# EasyEDA Pro project tianmengxing-expansion-board.epro, board PCB1
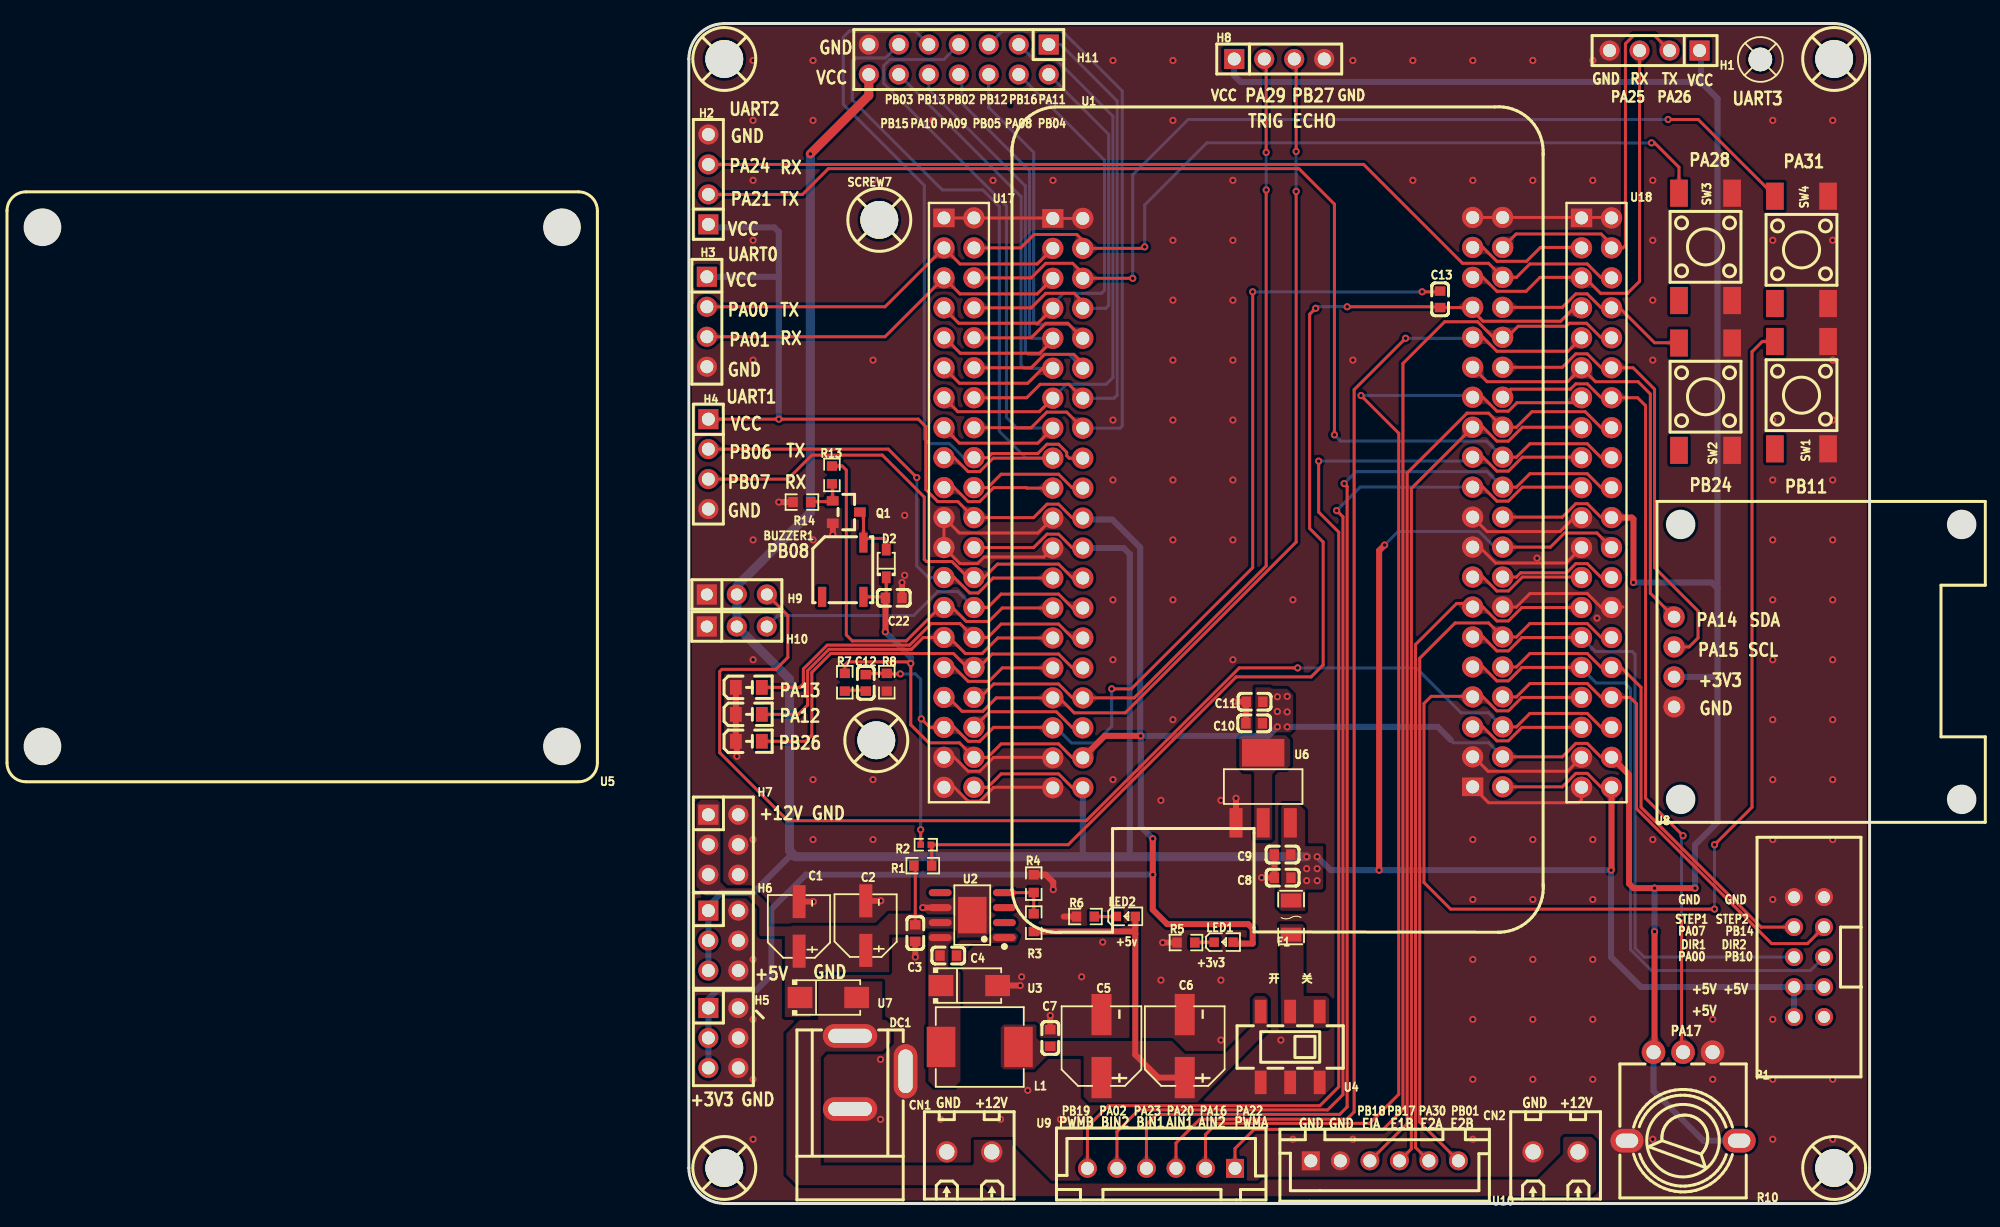
[diagram p2: board, top side]
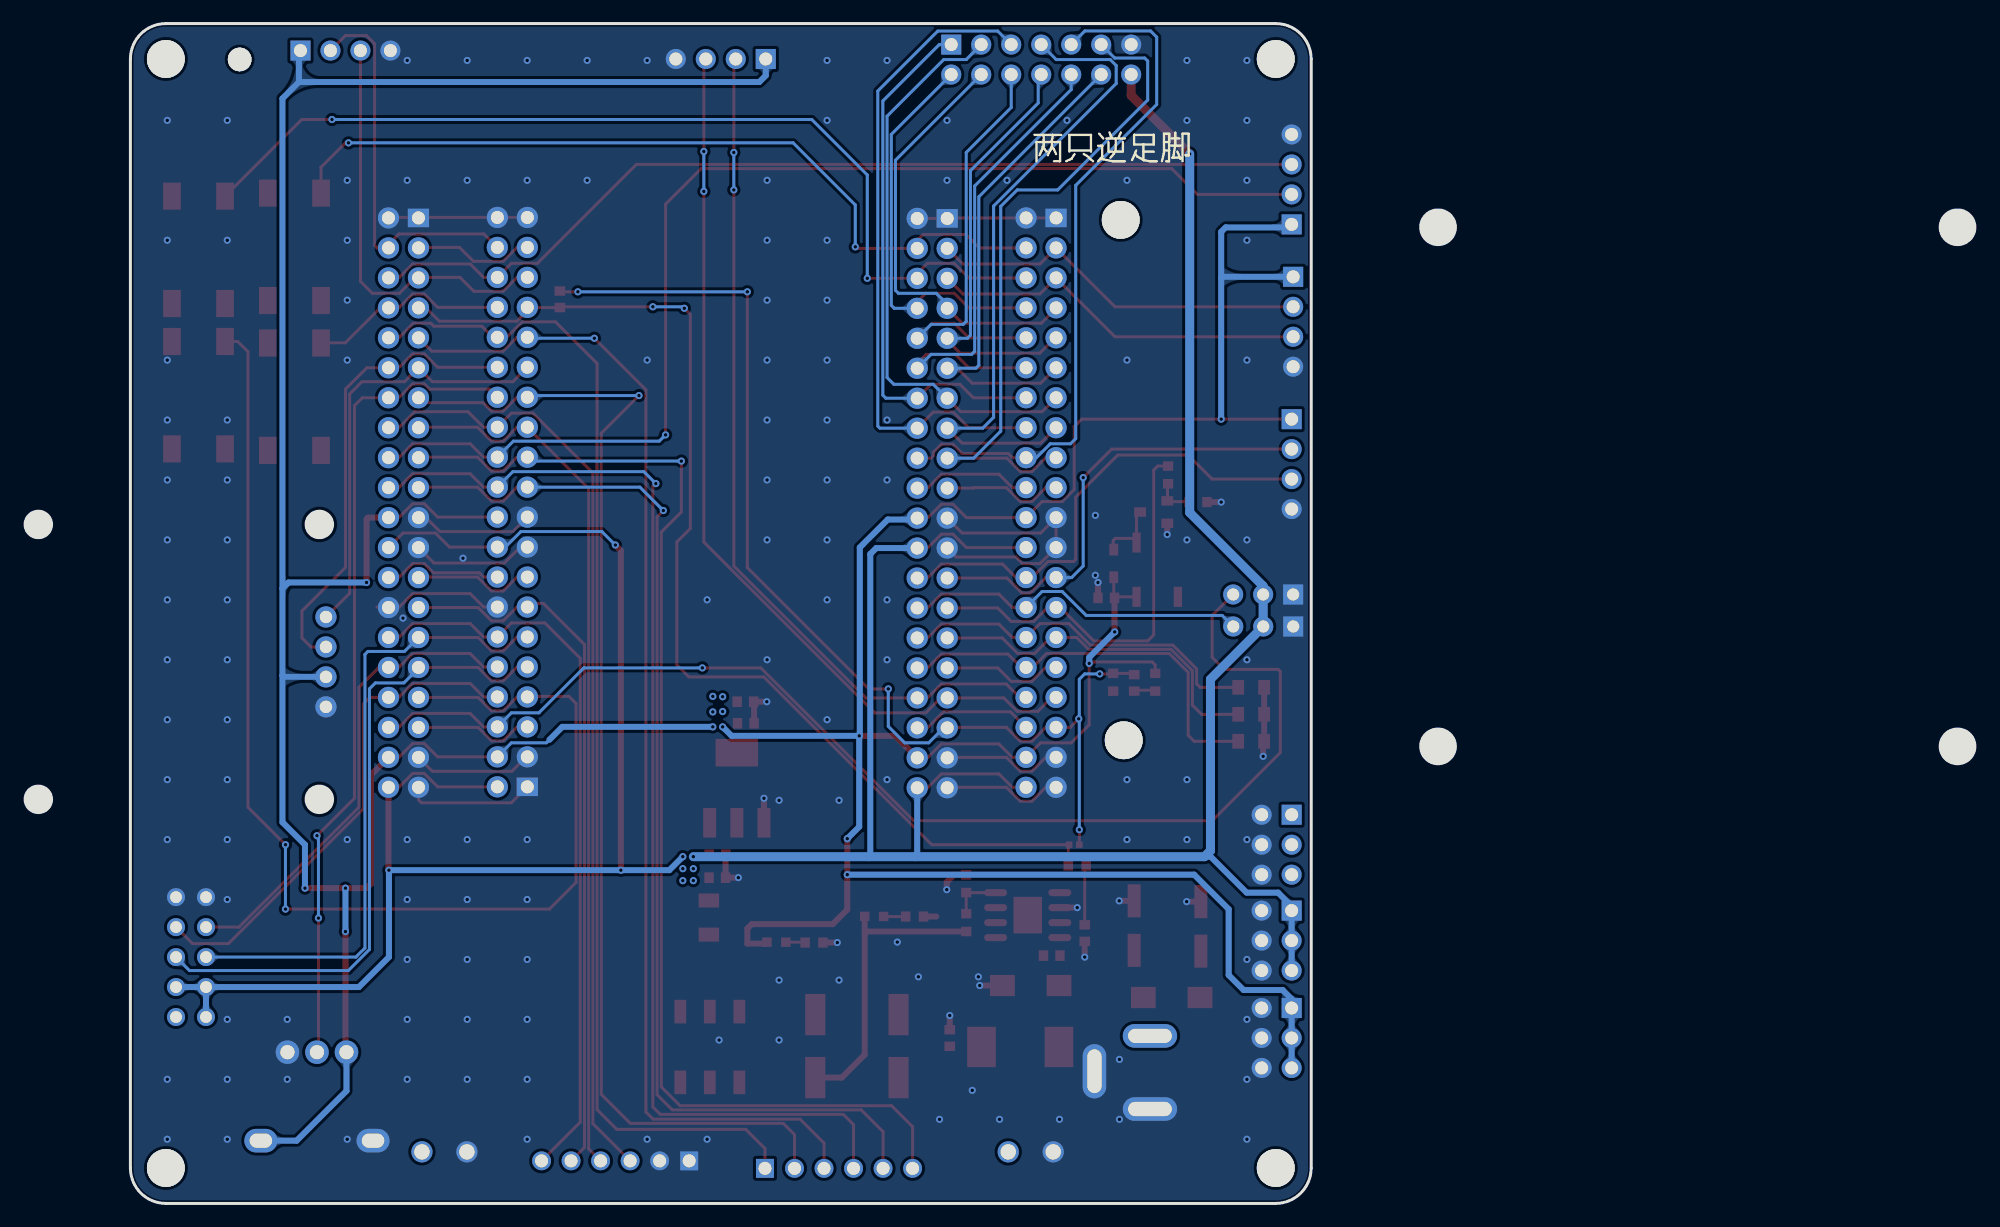
[diagram p3: board, bottom side, seen from below]

Outline 165.39 x 100 mm; copper layers: Top Layer, Bottom Layer. Coordinates in mm from the lower left corner of the outline.
Outline path: 56.34,97 56.34,3 arc(57.22,0.88) 59.34,0 153.34,0 arc(155.46,0.88) 156.34,3 156.34,97 arc(155.46,99.12) 153.34,100 59.34,100 arc(57.22,99.12) 56.34,97
Stack: Top Layer 0.035mm / Dielectric1 1.51mm FR4 er 4.5 / Bottom Layer 0.035mm

## Design rules (mm)
net GND: POWER
net DC+5V: POWER
net +12V: POWER
net VCC+3.3V: POWER
net VCC+5V: POWER
net VCCA+3.3V: POWER
spacing copperThickness1oz (default): track to track 0.102, other pairs 0.152 to 0.3
spacing copperThickness2oz: track to track 0.203, other pairs 0.152 to 0.3
track width copperThickness1oz (default): min 0.127, default 0.254, max 2.54
track width copperThickness2oz: min 0.203, default 0.254, max 2.54
track width POWER: min 0.254, default 0.508, max 2.54
differential pair differentialPair (default): width min 0.127, default 0.254, max 2.54; gap min 0.152, default 0.152
net +12V uses POWER, copperRegion
net DC+5V uses POWER
net GND uses POWER, copperRegion
net VCC+3.3V uses POWER, copperRegion
net VCC+5V uses POWER, copperRegion
net VCCA+3.3V uses POWER
net class POWER uses POWER

## Placement (name value [footprint] x y rotation side)
BUZZER1  4kHz  [BUZ-SMD_L5.0-W5.5-P4.60]  69.38 53.71 90 top
C1  4.7uF  [CAP-SMD_BD5.0-L5.3-W5.3-FD]  65.68 23.48 90 top
C2  4.7uF  [CAP-SMD_BD5.0-L5.3-W5.3-FD]  71.33 23.55 90 top
C3  100nF  [C0603]  75.52 22.91 90 top
C4  10nF  [C0603]  78.31 21.01 180 top
C5  100uF  [CAP-SMD_BD6.3-L6.6-W6.6-LS7.6-FD-1]  91.29 13.33 90 top
C6  100uF  [CAP-SMD_BD6.3-L6.6-W6.6-LS7.6-FD-1]  98.34 13.33 90 top
C7  100nF  [C0603]  86.95 14.02 270 top
C8  10uF  [C0603]  106.63 27.61 0 top
C9  100nF  [C0603]  106.62 29.57 0 top
C10  10uF  [C0603]  104.22 40.69 0 top
C11  100nF  [C0603]  104.25 42.52 0 top
C12  100nF  [C0603]  71.33 44.12 270 top
C13  100nF  [C0603]  119.97 76.63 270 top
C22  100nF  [C0603]  73.7 51.32 0 top
CN1  MX128L-3.81-02P-GN01-Cu-Y-A  [CONN-TH_2P-P3.81_MX128L-3.81-GN01-02P-CU-Y-A]  80.09 4.37 0 top
CN2  MX128L-3.81-02P-GN01-Cu-Y-A  [CONN-TH_2P-P3.81_MX128L-3.81-GN01-02P-CU-Y-A]  129.75 4.37 0 top
D2  1N5819WS  [SOD-323_L1.8-W1.3-LS2.5-RD]  73.06 54.24 90 top
DC1  -  [DC-005_2.5]  70.31 10.97 270 top
F1  JK-nSMD050-30  [F1206]  107.35 24.23 90 top
H1  2.54-1*4P母  [HDR-TH_4P-P2.54-V-F]  138.13 97.71 180 top
H2  PZ254V-11-04P  [HDR-TH_4P-P2.54-V-M]  57.99 86.79 90 top
H3  2.54-1*4P母  [HDR-TH_4P-P2.54-V-F]  57.87 74.73 270 top
H4  PZ254V-11-04P  [HDR-TH_4P-P2.54-V-M]  57.99 62.66 270 top
H5  PZ254V-12-6P  [HDR-TH_6P-P2.54-V-M-R2-C3-S2.54]  59.26 14.02 270 top
H6  PZ254V-12-6P  [HDR-TH_6P-P2.54-V-M-R2-C3-S2.54]  59.26 22.28 270 top
H7  PZ254V-12-6P  [HDR-TH_6P-P2.54-V-M-R2-C3-S2.54]  59.26 30.4 270 top
H8  2.54-1*4P母  [HDR-TH_4P-P2.54-V-F]  106.34 97 0 top
H9  PZ254V-11-03P  [HDR-TH_3P-P2.54-V-M_PZ254V-11-03P]  60.41 51.61 0 top
H10  PZ254V-11-03P  [HDR-TH_3P-P2.54-V-M_PZ254V-11-03P]  60.4 48.9 0 top
H11  PZ254V-12-14P  [HDR-TH_14P-P2.54-V-M-R2-C7-S2.54]  79.2 96.95 180 top
L1  15uH  [IND-SMD_L7.3-W6.6]  80.98 13.26 180 top
LED1  -  [LED_0603]  101.68 22.15 0 top
LED2  -  [LED_0603]  93.4 24.33 0 top
LED3  NCD0805R1  [LED0805-RD]  61.42 43.74 0 top
LED4  NCD0805R1  [LED0805-RD]  61.42 41.45 0 top
LED5  NCD0805R1  [LED0805-RD]  61.42 39.17 0 top
P1  2.54-2*5P简牛  [IDC-TH_10P-P2.54_C5665]  151.21 20.88 90 top
Q1  SS8050  [SOT-23_L2.9-W1.3-P1.90-LS2.4-BR]  69.68 58.6 180 top
R1  33kΩ  [R0603]  76.15 28.63 180 top
R2  10kΩ  [R0402]  76.41 30.4 0 top
R3  10K  [R0603]  85.55 23.8 270 top
R4  3.16K  [R0603]  85.55 27.1 90 top
R5  2K  [R0603]  98.44 22.11 0 top
R6  5K  [R0603]  89.93 24.31 0 top
R7  0  [R0603]  69.55 44.17 270 top
R8  0  [R0603]  73.11 44.17 90 top
R10  10kΩ  [RES-ADJ-TH_RK09L1140A5L]  140.54 9.07 180 top
R13  560Ω  [R0603]  68.46 61.75 270 top
R14  10kΩ  [R0603]  65.92 59.44 180 top
SCREW1  -  [M3螺丝]  59.34 97 0 top
SCREW2  -  [M3螺丝]  153.34 97 0 top
SCREW3  -  [M3螺丝]  59.34 3 0 top
SCREW4  -  [M3螺丝]  153.34 3 0 top
SCREW5  -  [M2螺丝]  147.09 96.96 0 top
SCREW7  -  [M3螺丝]  72.47 83.36 0 top
SCREW8  -  [M3螺丝]  72.22 39.25 0 top
SW1  KH-6X6X5H-STM  [SW-SMD_4P-L6.0-W6.0-P4.50-LS9.0_H5.0]  150.58 68.5 270 top
SW2  KH-6X6X5H-STM  [SW-SMD_4P-L6.0-W6.0-P4.50-LS9.0_H5.0]  142.45 68.38 270 top
SW3  KH-6X6X5H-STM  [SW-SMD_4P-L6.0-W6.0-P4.50-LS9.0_H5.0]  142.45 81.08 270 top
SW4  KH-6X6X5H-STM  [SW-SMD_4P-L6.0-W6.0-P4.50-LS9.0_H5.0]  150.58 80.82 270 top
U1  LCKFB-TMX-MSPM0G3507  [COMM-TH_LCKFB-TMX-MSPM0G3507]  106.22 59.4 0 top
U2  TPS5450QDDARQ1  [SOIC-8_L4.9-W3.9-P1.27-LS6.0-BL-EP]  80.35 24.44 90 top
U3  SS54  [SMA_L4.2-W2.6-LS5.1-RD]  80.09 18.47 0 top
U4  YSSP2AG00  [SW-SMD_YSSP2AG00]  107.27 13.26 180 top
U5  -  [轮趣科技电机驱动]  48.6 35.74 180 top
U6  AMS1117-3.3  [SOT-223-3_L6.5-W3.4-P2.30-LS7.0-BR]  104.98 35.23 270 top
U7  SS54  [SMA_L4.2-W2.6-LS5.1-RD]  68.15 17.45 0 top
U8  HS96L03W2C03  [OLED-TH_L27.8-W27.2-P2.54_C9900033791]  139.78 45.9 90 top
U9  ZX-XH2.54-6PZZ  [CONN-TH_6P-P2.50_ZX-XH2.54-6PZZ]  96.35 2.97 0 top
U10  ZX-XH2.54-6PZZ  [CONN-TH_6P-P2.50_ZX-XH2.54-6PZZ]  115.27 3.61 180 top
U17  PZ2.54-2*20  [HDR-TH_40P-P2.54-V-M-R2-C20-S2.54]  79.22 59.4 270 top
U18  PZ2.54-2*20  [HDR-TH_40P-P2.54-V-M-R2-C20-S2.54]  133.22 59.4 270 top

## Footprints (pads in the part's own frame, mm; a bottom-side part is the same pattern mirrored in y, then rotated)
BUZ-SMD_L5.0-W5.5-P4.60
  rect 1.7x0.7 smd: 1(-2.3,-1.75) 2(2.3,-1.75) 3(-2.3,1.75)
C0603
  rect 0.8x0.9 smd: 1(-0.7,0) 2(0.7,0)
CAP-SMD_BD5.0-L5.3-W5.3-FD
  rect 2.8x1.1 smd: 1(-2.1,0) 2(2.1,0)
CAP-SMD_BD6.3-L6.6-W6.6-LS7.6-FD-1
  rect 3.5x1.7 smd: 1(-2.67,0) 2(2.67,0)
COMM-TH_LCKFB-TMX-MSPM0G3507
  rect 1.8x1.575 hole 1.1: 1(-19.05,24.09) 41(16.51,-24.09)
  round 1.8 hole 1.1: 2(-16.51,24.09) 3(-19.05,21.549) 4(-16.51,21.549) 5(-19.05,19.009) 6(-16.51,19.009) 7(-19.05,16.47) 8(-16.51,16.47) 9(-19.05,13.93) 10(-16.51,13.93) 11(-19.05,11.389) 12(-16.51,11.389) 13(-19.05,8.85) 14(-16.51,8.85) 15(-19.05,6.309) 16(-16.51,6.309) 17(-19.05,3.769) 18(-16.51,3.769) 19(-19.05,1.23) 20(-16.51,1.23) 21(-19.05,-1.31) 22(-16.51,-1.31) 23(-19.05,-3.85) 24(-16.51,-3.85) 25(-19.05,-6.391) 26(-16.51,-6.391) 27(-19.05,-8.931) 28(-16.51,-8.931) 29(-19.05,-11.47) 30(-16.51,-11.47) 31(-19.05,-14.011) 32(-16.51,-14.011) 33(-19.05,-16.55) 34(-16.51,-16.55) 35(-19.05,-19.09) 36(-16.51,-19.09) 37(-19.05,-21.631) 38(-16.51,-21.631) 39(-19.05,-24.171) 40(-16.51,-24.171) 42(19.05,-24.09) 43(16.51,-21.549) 44(19.05,-21.549) 45(16.51,-19.009) 46(19.05,-19.009) 47(16.51,-16.47) 48(19.05,-16.47) 49(16.51,-13.93) 50(19.05,-13.93) 51(16.51,-11.389) 52(19.05,-11.389) 53(16.51,-8.85) 54(19.05,-8.85) 55(16.51,-6.309) 56(19.05,-6.309) 57(16.51,-3.769) 58(19.05,-3.769) 59(16.51,-1.23) 60(19.05,-1.23) 61(16.51,1.31) 62(19.05,1.31) 63(16.51,3.85) 64(19.05,3.85) 65(16.51,6.391) 66(19.05,6.391) 67(16.51,8.931) 68(19.05,8.931) 69(16.51,11.47) 70(19.05,11.47) 71(16.51,14.011) 72(19.05,14.011) 73(16.51,16.55) 74(19.05,16.55) 75(16.51,19.09) 76(19.05,19.09) 77(16.51,21.631) 78(19.05,21.631) 79(16.51,24.171) 80(19.05,24.171)
CONN-TH_2P-P3.81_MX128L-3.81-GN01-02P-CU-Y-A
  round 1.8 hole 1.3: 1(-1.905,0) 2(1.905,0)
CONN-TH_6P-P2.50_ZX-XH2.54-6PZZ
  rect 1.524x1.6 hole 1.1: 1(6.25,0)
  round 1.6 hole 1.1: 2(3.75,0) 3(1.25,0) 4(-1.25,0) 5(-3.75,0) 6(-6.25,0)
DC-005_2.5
  oval 2x4.6 hole 1.2x3.7: 1(-3.227,-0.318) 2(2.973,-0.318)
  oval 4.6x2 hole 3.7x1.2: 3(-0.227,4.382)
F1206
  rect 1.19x1.728 smd: 1(-1.445,0) 2(1.445,0)
HDR-TH_3P-P2.54-V-M_PZ254V-11-03P
  rect 1.7x1.7 hole 1.02: 1(-2.54,0)
  round 1.7 hole 1.02: 2(0,0) 3(2.54,0)
HDR-TH_4P-P2.54-V-F
  rect 1.7x1.7 hole 1.1: 1(-3.81,0)
  round 1.7 hole 1.1: 2(-1.27,0) 3(1.27,0) 4(3.81,0)
HDR-TH_4P-P2.54-V-M
  rect 1.7x1.7 hole 1.1: 1(-3.81,0)
  round 1.7 hole 1.1: 2(-1.27,0) 3(1.27,0) 4(3.81,0)
HDR-TH_6P-P2.54-V-M-R2-C3-S2.54
  rect 1.7x1.7 hole 1.1: 1(-2.54,-1.27)
  round 1.7 hole 1.1: 2(-2.54,1.27) 3(0,-1.27) 4(0,1.27) 5(2.54,-1.27) 6(2.54,1.27)
HDR-TH_14P-P2.54-V-M-R2-C7-S2.54
  rect 1.7x1.7 hole 1.1: 1(-7.62,-1.27)
  round 1.7 hole 1.1: 2(-7.62,1.27) 3(-5.08,-1.27) 4(-5.08,1.27) 5(-2.54,-1.27) 6(-2.54,1.27) 7(0,-1.27) 8(0,1.27) 9(2.54,-1.27) 10(2.54,1.27) 11(5.08,-1.27) 12(5.08,1.27) 13(7.62,-1.27) 14(7.62,1.27)
HDR-TH_40P-P2.54-V-M-R2-C20-S2.54
  rect 1.575x1.8 hole 1.1: 1(-24.13,-1.27)
  round 1.8 hole 1.1: 2(-24.13,1.27) 3(-21.59,-1.27) 4(-21.59,1.27) 5(-19.05,-1.27) 6(-19.05,1.27) 7(-16.51,-1.27) 8(-16.51,1.27) 9(-13.97,-1.27) 10(-13.97,1.27) 11(-11.43,-1.27) 12(-11.43,1.27) 13(-8.89,-1.27) 14(-8.89,1.27) 15(-6.35,-1.27) 16(-6.35,1.27) 17(-3.81,-1.27) 18(-3.81,1.27) 19(-1.27,-1.27) 20(-1.27,1.27) 21(1.27,-1.27) 22(1.27,1.27) 23(3.81,-1.27) 24(3.81,1.27) 25(6.35,-1.27) 26(6.35,1.27) 27(8.89,-1.27) 28(8.89,1.27) 29(11.43,-1.27) 30(11.43,1.27) 31(13.97,-1.27) 32(13.97,1.27) 33(16.51,-1.27) 34(16.51,1.27) 35(19.05,-1.27) 36(19.05,1.27) 37(21.59,-1.27) 38(21.59,1.27) 39(24.13,-1.27) 40(24.13,1.27)
IDC-TH_10P-P2.54_C5665
  round 1.524 hole 1: 1(-5.08,-1.27) 2(-5.08,1.27) 3(-2.54,-1.27) 4(-2.54,1.27) 5(0,-1.27) 6(0,1.27) 7(2.54,-1.27) 8(2.54,1.27) 9(5.08,-1.27) 10(5.08,1.27)
IND-SMD_L7.3-W6.6
  rect 2.424x3.42 smd: 1(3.278,0) 2(-3.278,0)
LED0805-RD
  rect 1x1.25 smd: 1(-1.1,0) 2(1.1,0)
LED_0603
  rect 0.8x0.8 smd: 1(-0.851,-0.01) 2(0.75,-0.005)
M2螺丝
  round 2 hole 2: 1(0,0)
M3螺丝
  round 3.2 hole 3.2: 1(0,0)
OLED-TH_L27.8-W27.2-P2.54_C9900033791
  round 1.8 hole 1.05: 1(-3.81,0) 2(-1.27,0) 3(1.27,0) 4(3.81,0)
R0402
  rect 0.566x0.54 smd: 1(-0.433,0) 2(0.433,0)
R0603
  rect 0.806x0.864 smd: 1(-0.753,0) 2(0.753,0)
RES-ADJ-TH_RK09L1140A5L
  round 2 hole 1.2: 1(-2.5,-3.75) 2(0,-3.75) 3(2.5,-3.75)
  oval 2.8x2 hole 1.9x1.2: 4(4.75,3.75) 5(-4.75,3.75)
SMA_L4.2-W2.6-LS5.1-RD
  rect 2.1x1.8 smd: 1(-2.4,0) 2(2.4,0)
SOD-323_L1.8-W1.3-LS2.5-RD
  rect 1x0.75 smd: 1(-1.173,0) 2(1.173,0)
SOIC-8_L4.9-W3.9-P1.27-LS6.0-BL-EP
  oval 0.602x1.941 smd: 1(-1.905,-2.72) 2(-0.635,-2.72) 3(0.635,-2.72) 4(1.905,-2.72) 5(1.905,2.72) 6(0.635,2.72) 7(-0.635,2.72) 8(-1.905,2.72)
  rect 3.098x2.41 smd: 9(0,0)
SOT-23_L2.9-W1.3-P1.90-LS2.4-BR
  rect 1x0.8 smd: 1(1.15,-0.95) 2(1.15,0.95) 3(-1.15,0)
SOT-223-3_L6.5-W3.4-P2.30-LS7.0-BR
  rect 2.5x1.1 smd: 1(2.97,-2.3) 2(2.97,0) 3(2.97,2.3)
  rect 2.34x3.6 smd: 4(-2.97,0)
SW-SMD_4P-L6.0-W6.0-P4.50-LS9.0_H5.0
  rect 2.3x1.5 smd: 1(-4.55,2.25) 2(4.55,2.25) 3(-4.55,-2.25) 4(4.55,-2.25)
SW-SMD_YSSP2AG00
  rect 1x2 smd: 1(-2.5,3) 2(0,3) 3(2.5,3) 4(-2.5,-3) 5(0,-3) 6(2.5,-3)

## Nets
As in the schematic.

Pads without a net: BUZZER1 3; P1 1; SCREW1 1; SCREW2 1; SCREW3 1; SCREW4 1; SCREW5 1; SCREW7 1; SCREW8 1; SW1 4; SW2 4; SW3 4; SW4 4; U2 2 3 5

## Via types
v1: diameter 0.61, hole 0.305, Top Layer to Bottom Layer, 201 vias

## Routing (per net, layer and track width the routed paths; a pad name or vN(x,y) marks a point on that pad's centre or on a via; arc(x,y) is an arc through that point)
+12V: length 4.7
  Top Layer w0.254: 75.52,28.29 75.52,23.61
+12v: length 0.5
  Top Layer w0.254: 75.52,28.29 75.18,28.63
AGND: length 96.2
  Top Layer w0.254: R2.1 v1(75.98,31.67) ; v1(74.25,44.88) 73.27,44.88 73.21,44.82 73.11,44.92 ; v1(118.45,77.27) 119.9,77.27 C13.1 ; v1(92.16,43.61) 93.82,43.61 104.09,53.89 v1(104.09,77.27) ; 73.11,44.92 71.43,44.92 C12.1 ; 73.11,44.92 73.11,44.93 ; v1(76.03,41.07) 76.75,40.35 78.82,40.35 80,39.17 80.97,39.17 82.15,40.35 87.12,40.35 87.17,40.31
  Bottom Layer w0.254: v1(75.98,31.67) 75.98,44.43 75.52,44.88 v1(74.25,44.88) ; 87.17,40.31 87.46,40.31 88.73,39.04 90.76,39.04 92.16,40.44 v1(92.16,43.61) ; v1(104.09,77.27) v1(118.45,77.27)
GND: length 150.6
  Top Layer w0.254: 131.95,35.27 131.95,34.21 131.69,33.96 124.07,33.96 122.73,35.31 ; 87.17,55.55 86.41,54.79 81.35,54.79 80.79,54.23 79.31,54.23 77.95,55.59 77.95,58.13 79.25,56.82 85.9,56.82 87.17,58.09 ; U1.54 126.43,50.55 127.57,51.69 132.43,51.69 133.57,50.55 135.46,50.55 ; 87.17,35.23 87.12,35.27 82.15,35.27 80.97,34.09 80,34.09 78.82,35.27 77.95,35.27 ; 131.95,55.59 130.64,54.28 124.67,54.28 123.32,55.63 122.73,55.63 ; 87.17,37.77 87.12,37.81 82.15,37.81 80.97,36.63 80,36.63 78.82,37.81 77.95,37.81 ; 122.73,83.57 U1.80 134.44,83.57 U18.2 ; 77.95,83.53 U17.2 87.12,83.53 87.17,83.49 U1.2 ; 122.73,58.17 123.95,56.95 130.13,56.95 131.31,58.13 131.95,58.13 ; 122.73,37.85 122.81,37.85 124.03,36.63 130.76,36.63 131.95,37.81
  Top Layer w0.508: U6.1 v1(102.68,34.34) ; R6.1 88.09,24.31 ; U3.2 v1(84.41,18.47) ; v1(87.2,26.59) 87.2,27.23 86.58,27.86 R4.2 ; C10.1 103.52,42.49 C11.1 v1(102.44,42.52) ; C1.2 v1(66.88,25.58) ; LED3.1 LED4.1 LED5.1 60.41,39.08 v1(60.41,37.9) ; v1(104.86,27.61) C8.1 105.93,29.56 C9.1 ; v1(68.53,56.69) 68.53,57.64 Q1.2 ; R5.1 v1(96.47,22.11) ; C2.2 v1(72.6,25.65) ; R14.2 v1(63.96,59.44) ; C7.1 v1(86.95,15.93) ; C22.2 v1(74.4,52.63) ; C3.1 v1(75.52,20.88) ; U2.6 v1(76.15,25.07)
  vias: v1(61.78,96.88) v1(61.78,91.8) v1(61.78,86.72) v1(61.78,81.64) v1(61.78,71.48) v1(61.78,56.24) v1(61.78,46.08) v1(61.78,30.84) v1(61.78,20.68) v1(61.78,15.6) v1(61.78,10.52) v1(61.78,5.44) v1(66.86,96.88) v1(66.86,91.8) v1(66.86,56.24) v1(66.86,35.92) v1(66.86,30.84) v1(71.94,86.72) v1(71.94,71.48) v1(71.94,35.92) v1(71.94,30.84) v1(72.58,12.2) v1(72.58,7.12) v1(74.62,58.32) v1(74.62,53.24) v1(77.02,91.8) v1(77.66,7.12) v1(82.1,86.72) v1(82.74,7.12) v1(84.53,19.21) v1(85.04,9.58) v1(87.18,91.8) v1(87.18,86.72) v1(87.82,7.12) v1(89.61,19.21) v1(91.39,22.15) v1(92.26,96.88) v1(92.26,66.4) v1(92.26,61.32) v1(92.26,51.16) v1(92.26,46.08) v1(92.26,35.92) v1(96.32,34.17) v1(96.32,18.93) v1(97.34,96.88) v1(97.34,91.8) v1(97.34,81.64) v1(97.34,76.56) v1(97.34,71.48) v1(97.34,66.4) v1(97.34,61.32) v1(97.34,56.24) v1(97.34,51.16) v1(97.34,41) v1(101.4,34.17) v1(101.4,18.93) v1(101.4,13.85) v1(102.42,86.72) v1(102.42,81.64) v1(102.42,76.56) v1(102.42,71.48) v1(102.42,66.4) v1(102.42,61.32) v1(102.42,56.24) v1(102.42,46.08) v1(106.48,13.85) v1(107.5,51.16) v1(107.5,5.44) v1(112.58,96.88) v1(112.58,71.48) v1(112.58,5.44) v1(117.66,96.88) v1(117.66,86.72) v1(122.74,96.88) v1(122.74,86.72) v1(122.74,30.84) v1(122.74,25.76) v1(122.74,20.68) v1(122.74,15.6) v1(122.74,10.52) v1(122.74,5.44) v1(127.82,96.88) v1(127.82,86.72) v1(127.82,30.84) v1(127.82,25.76) v1(127.82,20.68) v1(127.82,15.6) v1(127.82,10.52) v1(128.18,54.69) v1(132.9,96.88) v1(132.9,86.72) v1(132.9,30.84) v1(132.9,25.76) v1(132.9,20.68) v1(132.9,15.6) v1(132.9,10.52) v1(133.26,49.61) v1(137.98,86.72) v1(137.98,81.64) v1(137.98,76.56) v1(137.98,71.48) v1(137.98,30.84) v1(137.98,5.44) v1(143.06,15.6) v1(143.06,10.52) v1(148.14,91.8) v1(148.14,81.64) v1(148.14,66.4) v1(148.14,61.32) v1(148.14,56.24) v1(148.14,51.16) v1(148.14,46.08) v1(148.14,41) v1(148.14,35.92) v1(148.14,30.84) v1(148.14,25.76) v1(148.14,15.6) v1(148.14,10.52) v1(148.14,5.44) v1(153.22,91.8) v1(153.22,81.64) v1(153.22,71.48) v1(153.22,66.4) v1(153.22,61.32) v1(153.22,56.24) v1(153.22,51.16) v1(153.22,46.08) v1(153.22,41) v1(153.22,35.92) v1(153.22,30.84) v1(153.22,10.52) v1(153.22,5.44)
VCC+3.3V: length 437.4
  Top Layer w0.254: BUZZER1.1 72.91,51.41 73,51.32 73.06,51.39 D2.1 ; U1.22 89.66,58.13 88.79,58.13 87.65,59.27 86.68,59.27 85.54,58.13 U17.22 79.13,59.49 77.42,59.49 76.41,60.5 76.41,65.84 75.77,66.47 v1(63.96,66.47) H4.1 ; 69.55,44.93 69.55,45.64 69.8,45.9 75.01,45.9 v1(75.14,45.77) 75.14,40.56 76.66,39.04 79.25,39.04 U17.38 81.65,37.81 82.79,38.95 87.65,38.95 88.79,37.81 89.66,37.81 U1.38 ; U1.44 130.32,37.85 131.46,38.99 132.43,38.99 133.57,37.85 134.44,37.85 ; 133.57,58.17 132.43,59.31 131.46,59.31 130.32,58.17 U1.60
  Top Layer w0.508: LED1.2 102.55,22.02 104.09,22.02 104.09,23.29 103.71,23.67 96.86,23.67 95.63,24.9 v1(95.63,27.86) v1(95.63,30.91) ; U18.38 135.97,36.32 135.97,27.1 136.35,26.72 v1(138.13,26.72) v1(141.56,26.72) ; v1(138.13,23.04) 138.13,13.34 138.35,13.12 ; v1(136.34,52.63) 136.34,58 136.21,58.13 U18.22 ; 73,51.32 73,48.45 v1(72.98,48.44) ; U1.38 91.57,39.63 v1(94.62,39.63)
  Bottom Layer w0.254: 120.86,39.29 121.11,39.04 124.07,39.04 U1.44
  Bottom Layer w0.508: 143.46,52.12 143.46,44.74 ; 143.46,52.12 142.96,52.63 v1(136.34,52.63) ; 143.46,52.12 143.46,93.65 142.07,95.05 ; 143.46,44.74 143.35,44.63 U8.2 ; 143.46,44.74 143.46,32.31 141.56,30.4 v1(141.56,26.72) ; H2.1 58.25,82.73 63.58,82.73 63.96,82.35 63.96,78.41 ; v1(63.96,66.47) 63.96,78.41 ; 63.96,78.41 63.84,78.54 H3.1 ; H8.1 102.53,95.59 103.08,95.05 142.07,95.05 ; v1(106.19,40.39) 105.42,39.63 v1(94.62,39.63) ; H1.1 142.07,97.59 142.07,95.05 ; R10.3 138.04,9.54 142.26,5.32 R10.5 ; v1(94.62,39.63) 94.62,31.93 v1(95.63,30.91) ; v1(94.62,39.63) 94.57,39.67 94.57,55.59 92.2,57.96 89.83,57.96 U1.22 ; v1(95.63,27.86) 66.25,27.86 63.33,24.94 63.33,19.35 62.06,18.09 58.76,18.09 57.99,17.32 H5.1 H5.3 H5.5 ; v1(107.02,40.39) 119.76,40.39 120.86,39.29 ; v1(72.98,48.44) 75.14,46.28 v1(75.14,45.77) ; v1(138.13,26.72) v1(138.13,23.04)
  vias: v1(106.19,42.94) v1(106.19,41.69) v1(107.02,42.98) v1(107.02,41.66)
VCC+5V: length 307.6
  Top Layer w0.254: U18.24 133.25,56.82 130.51,56.82 129.31,55.63 U1.58 ; U17.40 81.65,35.27 82.79,36.41 87.65,36.41 88.79,35.27 89.66,35.27 U1.40 ; U17.24 85.54,55.59 86.68,56.73 87.65,56.73 88.79,55.59 89.66,55.59 U1.24 ; U18.40 134.44,35.31 133.57,35.31 132.43,36.45 131.46,36.45 130.32,35.31 U1.42
  Top Layer w0.508: U18.40 134.49,28.28 v1(134.45,28.25) ; v1(114.8,28.25) 114.8,55.34 v1(115.27,55.8)
  Top Layer w0.762: H11.14 71.58,93.9 v1(66.63,88.95)
  Bottom Layer w0.254: v1(115.27,55.8) 116.41,56.95 123.27,56.95 124.59,55.63 U1.58
  Bottom Layer w0.508: U1.40 89.71,29.55 89.87,29.39 ; 93.81,29.39 93.68,29.51 93.68,55.04 93.17,55.55 U1.24 ; P1.4 136.99,18.34 134.45,20.88 v1(134.45,28.25) v1(114.8,28.25) 110.7,28.25 v1(109.56,29.39) ; P1.4 P1.3 ; P1.4 149.94,15.8 ; H6.5 H6.3 H6.1 57.99,25.2 59.14,26.34 61.8,26.34 64.85,29.39 65.38,29.39
  Bottom Layer w0.762: v1(108.67,29.39) 65.38,29.39 64.87,29.9 64.87,44.43 H10.2 60.41,48.91 H9.2 60.41,52.33 66.63,58.55 v1(66.63,88.95)
  vias: v1(108.67,28.37) v1(108.67,27.36) v1(109.56,28.37) v1(109.56,27.36)
VCCA+3.3V: length 1.8
  Top Layer w0.254: 71.33,43.55 71.27,43.49 69.55,43.49
A27: length 10.2
  Top Layer w0.254: 122.73,81.03 123.6,81.03 124.78,79.85 127.29,79.85 128.47,81.03 131.9,81.03 131.95,80.99
ADC_BATTERY: length 31.6
  Top Layer w0.254: 122.73,75.95 122.73,75.65 123.61,74.77 130.17,74.77 131.31,75.91 ; 88.47,30.4 102.7,44.63 ; 76.91,28.63 76.91,30.34 76.84,30.4
ADC_battery: length 64.3
  Top Layer w0.254: v1(112.1,76) 119.9,76 C13.2 122.71,75.93 122.73,75.95 ; R2.2 88.47,30.4 ; v1(109.43,75.87) 108.92,75.36 108.92,57.2 110.06,56.06 110.06,45.64 109.05,44.63 102.7,44.63 ; 131.31,75.91 131.95,75.91
  Bottom Layer w0.254: v1(112.1,76) 109.56,76 v1(109.43,75.87)
AIN1: length 101.6
  Top Layer w0.254: U9.3 97.6,5.11 99.62,7.14 112.07,7.14 112.69,7.75 112.69,68.97 v1(117.05,73.33) ; 131.95,73.37 130.81,72.23 124.78,72.23 123.6,73.41 122.73,73.41
  Bottom Layer w0.254: v1(117.05,73.33) 122.65,73.33 122.73,73.41
AIN2: length 100.9
  Top Layer w0.254: 131.95,68.29 131.53,67.87 126.47,67.87 125.75,67.15 124.78,67.15 123.6,68.33 122.73,68.33 ; U9.2 100.1,5.83 101.05,6.78 114,6.78 116.46,9.25 116.46,65.28 v1(113.27,68.47)
  Bottom Layer w0.254: 122.73,68.33 122.58,68.47 v1(113.27,68.47)
B21: length 10.2
  Top Layer w0.254: 131.95,53.05 131.28,53.05 131.24,53.09 126.93,53.09 125.75,51.91 124.78,51.91 123.6,53.09 122.73,53.09
B22: length 10.2
  Top Layer w0.254: U1.56 126.43,53.09 126.79,53.44 130.67,53.44 131.46,54.23 132.43,54.23 133.57,53.09 134.44,53.09 U18.26
B23: length 10.2
  Top Layer w0.254: 77.95,45.43 78.82,45.43 80,44.25 81.74,44.25 82.88,45.39 87.17,45.39
BIN1: length 98.8
  Top Layer w0.254: U9.4 95.1,6.68 95.97,7.54 111.46,7.54 112.1,8.18 112.1,60.76 v1(111.84,61.01) ; U1.62 126.43,60.71 127.57,61.85 132.43,61.85 133.57,60.71 134.44,60.71 U18.20
  Bottom Layer w0.254: v1(111.84,61.01) 112.86,62.03 123.95,62.03 U1.62
BIN2: length 95.8
  Top Layer w0.254: v1(111.21,58.72) 111.74,58.19 111.74,9.22 110.44,7.93 94.44,7.93 92.6,6.08 U9.5 ; 122.73,60.71 123.6,60.71 124.78,59.53 125.75,59.53 126.93,60.71 131.9,60.71 131.95,60.67
  Bottom Layer w0.254: 122.73,60.71 113.19,60.71 v1(111.21,58.72)
BUZZER: length 35.2
  Top Layer w0.254: R13.1 69.33,62.5 69.68,62.15 69.68,48.18 70.19,47.67 74.75,47.67 77.59,50.51 78.66,50.51 79.84,49.33 81.74,49.33 82.88,50.47 87.17,50.47
CHIP: length 10.3
  Top Layer w0.254: U1.36 89.66,40.35 88.79,40.35 87.47,41.67 81.81,41.67 U17.36
CLK: length 10.2
  Top Layer w0.254: U17.20 81.65,60.67 82.79,61.81 87.65,61.81 88.79,60.67 89.66,60.67 U1.20
CODER: length 68.6
  Top Layer w0.254: v1(140.54,31.17) 137.37,34.34 137.37,67.61 136.7,68.29 U18.14 ; U1.68 125.95,69.01 131,69.01 131.46,69.47 132.43,69.47 133.57,68.33 ; R10.2 140.42,12.94 v1(140.42,24.18)
  Bottom Layer w0.254: v1(140.42,24.18) 140.42,31.04 v1(140.54,31.17)
DC+5V: length 25.4
  Top Layer w0.508: 94.15,22.86 94.15,12.6 96.09,10.66 C6.1 ; 94.15,22.86 94.15,24.33 ; 94.15,22.86 93.96,23.05 R3.2
DIO: length 10.2
  Top Layer w0.254: 87.17,60.63 84.96,60.63 84.92,60.67 82.15,60.67 80.97,59.49 80,59.49 78.82,60.67 77.95,60.67
DIR1: length 54
  Top Layer w0.254: 131.95,47.97 126.89,47.97 125.75,46.83 124.78,46.83 123.6,48.01 122.73,48.01
  Bottom Layer w0.254: P1.6 137.24,20.88 136.48,21.64 136.48,46.53 136.23,46.79 133.13,46.79 131.95,47.97
DIR2: length 54.8
  Top Layer w0.254: 131.95,45.43 126.89,45.43 125.75,44.29 124.78,44.29 123.6,45.47 122.73,45.47
  Bottom Layer w0.254: P1.5 151.34,19.74 137.88,19.74 136.1,21.52 136.1,43.61 135.59,44.12 133.18,44.12 131.95,45.35 131.95,45.43
E1A: length 80.6
  Top Layer w0.254: U10.3 117.18,6.76 117.18,61.91 122.24,66.97 122.24,66.97 122.26,66.98 124.07,66.98 U1.66 126.43,65.79 127.75,67.11 132.25,67.11 133.57,65.79 134.44,65.79 U18.16
E1B: length 75
  Top Layer w0.254: U10.4 117.53,4.62 117.53,60.59 122.73,65.79 123.6,65.79 124.78,64.61 125.75,64.61 126.93,65.79 131.9,65.79 131.95,65.75
E2A: length 60.8
  Top Layer w0.254: 131.95,50.51 126.89,50.51 125.75,49.37 124.78,49.37 123.6,50.55 122.73,50.55 122.42,50.85 121.37,50.85 117.89,47.37 117.89,4.74 U10.5
E2B: length 62.9
  Top Layer w0.254: U10.6 118.24,6.88 118.24,46.2 121.24,49.2 124.07,49.2 U1.52 126.43,48.01 127.57,49.15 132.43,49.15 133.57,48.01 134.44,48.01 U18.30
ECHO: length 78.3
  Top Layer w0.254: v1(107.78,89.16) 107.78,96.84 H8.3 ; 77.95,42.89 78.3,42.89 79.48,41.71 81.24,41.71 82.37,42.85 87.71,42.85 88.98,41.58 93.3,41.58 107.78,56.06 v1(107.78,85.78)
  Bottom Layer w0.254: v1(107.78,85.78) v1(107.78,89.16)
FB: length 4.3
  Top Layer w0.254: 85.55,24.68 85.55,26.48 85.42,26.34 U2.4
IMU_RX_UART3: length 35.6
  Top Layer w0.254: H1.3 136.86,78.16 135.84,77.14 133.56,77.14 132.25,78.45 131.95,78.45 131.9,78.49 128.43,78.49 127.25,77.31 124.78,77.31 123.6,78.49 122.73,78.49
IMU_TX_UART3: length 33.3
  Top Layer w0.254: H1.2 138.13,98.98 136.35,98.98 135.66,98.3 135.66,81.2 135.45,80.99 U18.4 134.49,81.29 133.61,82.17 126.4,82.17 U1.78
KEY1: length 105.9
  Top Layer w0.254: 131.95,42.89 126.89,42.89 125.75,41.75 124.78,41.75 123.6,42.93 122.73,42.93 122.68,42.98 119.21,42.98 118.6,42.37 118.6,27.2 120.86,24.94 v1(143.21,24.94) ; v1(143.21,30.4) 146.39,33.58 146.39,72.19 147.25,73.05 148.07,73.05
  Bottom Layer w0.254: v1(143.21,30.4) v1(143.21,24.94)
KEY2: length 17.1
  Top Layer w0.254: 140.2,72.93 140.18,72.95 138.13,72.95 135.17,75.91 U18.8 134.44,75.95 133.57,75.95 132.43,77.09 131.46,77.09 130.32,75.95 U1.74
KEY3: length 69.9
  Top Layer w0.254: v1(94.95,81.08) 94.82,80.95 U1.4 89.71,81.62 89.2,82.13 85.59,82.13 84.45,80.99 U17.4 ; SW3.3 140.2,87.82 138.13,89.89 v1(137.88,89.89)
  Bottom Layer w0.254: v1(94.95,81.08) 94.95,84.63 100.21,89.89 v1(137.88,89.89)
KEY4: length 82.5
  Top Layer w0.254: v1(93.93,78.41) 89.71,78.41 U1.6 89.71,78.83 88.85,79.68 86.57,79.68 85.34,78.45 U17.6 ; v1(139.27,91.87) 141.83,91.87 SW4.3
  Bottom Layer w0.254: v1(139.27,91.87) 98.63,91.87 93.93,87.17 v1(93.93,78.41)
LED1: length 31.6
  Top Layer w0.254: U1.30 88.83,47.93 87.65,49.11 82.79,49.11 81.65,47.97 U17.30 79.31,49.15 76.87,49.15 75.04,47.32 68.06,47.32 66.04,45.3 66.04,44.04 65.74,43.74 LED3.2
LED2: length 30.3
  Top Layer w0.254: 62.4,41.45 65.61,41.45 66.4,42.24 66.4,45.16 68.21,46.96 75.19,46.96 76.19,47.97 78.4,47.97 79.76,46.61 81.18,46.61 82.5,47.93 87.17,47.93
LED3: length 34.8
  Top Layer w0.254: LED5.2 66.25,39.17 66.76,39.67 66.76,45.01 68.35,46.61 78.75,46.61 79.93,45.43 U17.32 80.89,45.43 82.03,46.57 87.65,46.57 88.79,45.43 89.66,45.43 U1.32
PWMA: length 101.2
  Top Layer w0.254: U9.1 102.6,4.65 104.22,6.27 115.14,6.27 116.82,7.95 116.82,71.2 120.35,74.73 123.15,74.73 124.47,73.41 U1.72 125.64,73.41 126.57,74.35 130.64,74.35 130.89,74.6 132.38,74.6 133.57,73.41 134.44,73.41 U18.10
PWMB: length 103.3
  Top Layer w0.254: 131.95,63.21 131.9,63.25 126.93,63.25 125.75,62.07 124.78,62.07 123.6,63.25 122.73,63.25 ; U9.6 90.1,6.5 91.88,8.28 109.78,8.28 111.38,9.88 111.38,56.9 109.68,58.6 v1(109.68,62.92)
  Bottom Layer w0.254: 122.73,63.25 122.39,62.92 v1(109.68,62.92)
RST: length 10.2
  Top Layer w0.254: 131.95,40.35 126.89,40.35 125.75,39.21 124.78,39.21 123.6,40.39 122.73,40.39
RX_UART0: length 32.5
  Top Layer w0.254: 87.17,78.41 85.84,77.09 79.31,77.09 77.95,78.45 72.95,73.46 57.87,73.46
RX_UART1: length 40.9
  Top Layer w0.254: H4.3 64.72,61.39 66.76,63.42 72.73,63.42 76.28,59.87 76.28,54.59 76.46,54.41 78.62,54.41 79.98,53.05 U17.26 81.34,53.05 82.48,54.19 87.65,54.19 88.83,53.01 U1.26
RX_UART2: length 81.4
  Top Layer w0.254: U18.6 134.44,78.49 133.57,78.49 132.43,79.63 127.57,79.63 126.43,78.49 U1.76 124.07,79.68 121.87,79.68 113.49,88.06 H2.3
SCL: length 38.6
  Top Layer w0.254: U1.70 130.32,70.87 131.46,72.01 132.43,72.01 133.57,70.87 ; U18.12 136.31,70.83 138.13,69.01 138.13,53.9 141.81,50.22 141.81,47.93 141.05,47.17 U8.3
SDA: length 36.7
  Top Layer w0.254: U8.4 137.77,51.72 137.77,68.61 136.73,69.65 133.13,69.65 131.95,70.83 130.76,69.65 123.95,69.65 122.73,70.87
SERVO1: length 105.5
  Top Layer w0.254: v1(107.9,45.39) 102.96,45.39 90,32.44 64.72,32.44 58.96,38.2 58.96,45.08 59.14,45.26 63.71,45.26 64.72,46.28 64.72,49.83 H9.3 ; U1.46 126.43,40.39 127.57,41.53 132.43,41.53 133.57,40.39 134.44,40.39 U18.36
  Bottom Layer w0.254: v1(107.9,45.39) 117.94,45.39 121.75,41.58 124.07,41.58 U1.46
SERVO2: length 29.5
  Top Layer w0.254: U17.28 81.65,50.51 82.79,51.65 87.65,51.65 88.83,50.47 U1.28
  Bottom Layer w0.254: H10.3 63.88,49.83 75.39,49.83 77.42,51.87 79.13,51.87 U17.28
STEP1: length 40.7
  Top Layer w0.254: 149.94,23.42 147.15,23.42 136.99,33.58 136.99,43.74 135.3,45.43 U18.32 134.44,45.47 133.57,45.47 132.43,46.61 127.57,46.61 126.43,45.47 U1.50
STEP2: length 42.6
  Top Layer w0.254: U1.48 126.43,42.93 127.57,44.07 132.43,44.07 133.57,42.93 134.44,42.93 U18.34 136.06,42.89 136.61,42.34 136.61,33.46 148.04,22.02 151.08,22.02 152.48,23.42
TRACK1: length 34.5
  Top Layer w0.254: U17.8 85.34,75.91 86.57,77.14 88.98,77.14 89.71,76.42 U1.8
  Bottom Layer w0.254: U1.8 91.65,75.87 91.9,76.12 91.9,90.6 H11.2
TRACK2: length 36.8
  Top Layer w0.254: 77.95,75.91 77.95,75.86 79.2,74.6 85.9,74.6 87.17,75.87
  Bottom Layer w0.254: H11.4 91.55,88.42 91.55,77.39 91.29,77.14 88.09,77.14 87.17,76.21 87.17,75.87
TRACK3: length 37.5
  Top Layer w0.254: U1.10 88.43,74.6 86.57,74.6 85.34,73.37 U17.10
  Bottom Layer w0.254: U1.10 88.53,74.51 85.81,74.51 85.55,74.76 85.55,89.08 81.74,92.89 H11.6
TRACK4: length 37
  Top Layer w0.254: 77.95,73.37 78.02,73.37 79.33,72.06 86.06,72.06 87.17,73.17 87.17,73.33
  Bottom Layer w0.254: H11.8 79.46,95.43 79.46,93.27 85.2,87.53 85.2,73.58 85.45,73.33 87.17,73.33
TRACK5: length 42.7
  Top Layer w0.254: U17.12 85.34,70.83 86.47,71.97 88.95,71.97 89.71,71.21 U1.12
  Bottom Layer w0.254: U1.12 88.53,71.97 85.09,71.97 84.84,72.22 84.84,86.23 76.66,94.41 H11.10
TRACK6: length 42
  Top Layer w0.254: 87.17,70.79 86.31,70.79 85.04,69.52 79.25,69.52 77.95,70.83
  Bottom Layer w0.254: H11.12 84.48,85.32 84.48,71.04 84.74,70.79 87.17,70.79
TRACK7: length 45.9
  Top Layer w0.254: U1.14 88.53,69.43 86.09,69.43 84.96,68.29 U17.14
  Bottom Layer w0.254: H11.1 87.84,98.22 92.61,93.45 92.61,68.5 92.36,68.25 U1.14
TRACK8: length 48.6
  Top Layer w0.254: 87.17,68.25 86.02,67.11 79.13,67.11 77.95,68.29
  Bottom Layer w0.254: H11.3 85.55,96.95 87.46,96.95 92.26,92.15 92.26,70 91.68,69.43 88.34,69.43 87.17,68.25
TRACK9: length 56
  Top Layer w0.254: U1.16 88.34,67.07 86.66,67.07 85.34,65.75 U17.16
  Bottom Layer w0.254: U1.16 92.87,65.71 93.05,65.89 93.05,94.28 87.97,99.37 82.89,99.37 H11.5
TRACK10: length 55.8
  Top Layer w0.254: 87.17,65.71 85.9,64.44 79.25,64.44 77.95,65.75
  Bottom Layer w0.254: H11.7 77.93,96.95 73.36,96.95 72.85,96.44 72.85,94.92 83.23,84.54 83.23,66.63 84.16,65.71 87.17,65.71
TRACK11: length 60
  Top Layer w0.254: U1.18 88.55,63.17 88.34,63.37 88.34,63.66 87.65,64.35 86.68,64.35 85.89,63.56 82.01,63.56 81.65,63.21 U17.18
  Bottom Layer w0.254: U17.18 79.61,63.21 78.43,64.39 76.72,64.39 76.28,64.82 76.28,86.28 69.42,93.14 69.42,98.86 69.94,99.38 75.51,99.38 H11.9
TRACK12: length 58.7
  Top Layer w0.254: 77.95,63.21 78.82,63.21 80,62.03 80.97,62.03 82.11,63.17 87.17,63.17
  Bottom Layer w0.254: H11.11 72.98,97.08 70.44,97.08 70.19,96.83 70.19,93.52 77.81,85.9 81.23,85.9 82.63,84.51 82.63,65.46 84.92,63.17 87.17,63.17
TRIG: length 73.4
  Top Layer w0.254: v1(105.24,85.9) 105.24,54.03 94.06,42.85 U1.34 89.66,42.89 88.79,42.89 87.65,44.03 82.16,44.03 81.02,42.89 U17.34 ; H8.2 105.24,96.84 v1(105.24,89.08)
  Bottom Layer w0.254: v1(105.24,85.9) v1(105.24,89.08)
TX_UART0: length 32.5
  Top Layer w0.254: 87.17,80.95 85.84,79.63 79.31,79.63 77.95,80.99 72.95,76 H3.2
TX_UART1: length 39.1
  Top Layer w0.254: 87.17,53.01 82.11,53.01 80.84,51.74 80.13,51.74 78.82,53.05 77.95,53.05 ; v1(75.65,61.52) 73.23,63.93 H4.2
  Bottom Layer w0.254: v1(75.65,61.52) 75.65,54.03 76.62,53.05 77.95,53.05
TX_UART2: length 99.9
  Top Layer w0.254: U1.64 126.43,63.25 127.57,64.39 132.43,64.39 133.57,63.25 134.44,63.25 U18.18 ; v1(111.02,65.14) 111.02,84.69 108.01,87.71 68.15,87.71 65.97,85.52 H2.2
  Bottom Layer w0.254: v1(111.02,65.14) 111.55,64.61 123.9,64.61 U1.64
$1N101: length 3.4
  Top Layer w0.254: R14.1 66.71,59.48 68.51,59.48 68.51,60.94 R13.2
$1N102: length 5.7
  Top Layer w0.254: BUZZER1.2 71.13,56.02 ; 71.13,56.02 71.48,56.36 72.93,56.36 73.11,56.19 73.11,55.46 D2.2 ; 71.13,56.02 71.13,58.29 Q1.3
$4N2883: length 1.6
  Top Layer w0.254: 99.2,22.11 99.23,22.14 LED1.1
$4N2994: length 1.9
  Top Layer w0.254: R6.2 92.54,24.31 LED2.1

## Copper pours and planes (outline as drawn; the poured copper is in the pictures)
+12V on Top Layer: 56.98,34.21 78.69,34.21 78.69,15.8 56.98,15.8
GND on Top Layer: 35.01,107.37 178.52,107.37 178.52,-19.38 35.01,-19.38
GND on Top Layer: 50.75,104.19 175.21,104.19 175.21,-3.38 50.75,-3.38
GND on Bottom Layer: 37.29,112.83 199.34,112.83 199.34,-34.87 37.29,-34.87
VCC+3.3V on Top Layer: 105.59,43.74 105.71,43.62 107,43.62 107.52,43.1 107.52,40.18 107.27,39.93 105.75,39.93 105.75,39.8 105.87,39.67 106.89,39.67 107.27,39.29 107.27,37.14 106.94,36.8 106.19,36.8 105.75,36.36 105.75,30.91 105.62,30.78 104.35,30.78 104.22,30.91 104.22,36.5 104.09,36.63 103.33,36.63 102.95,37.01 102.95,39.42 103.21,39.67 104.22,39.67 104.32,39.77 104.32,43.75
VCC+5V on Top Layer: 106.19,33.86 110.06,33.86 110.06,24.79 106.19,24.79
DC+5V on Top Layer: 82.76,17.58 105.38,17.58 105.38,8.56 82.76,8.56
$4N821 on Top Layer: 64.6,18.81 133.18,18.81 133.18,0.61 64.6,0.61
$4N1523 on Top Layer: 76.62,23.04 79.34,23.04 79.34,9.88 76.62,9.88
$4N1532 on Top Layer: 82.12,22.91 84.02,22.91 84.25,22.68 84.02,22.11 80.33,22.04 79.7,21.41 79.7,20.61 79.39,20.3 78.59,20.3 78.59,21.54 79.36,22.31 81.52,22.31
$4N6141 on Top Layer: 106.39,23.67 110.57,23.67 110.57,14.86 106.39,14.86

Small or netless copper shapes (teardrops, artwork), in the pictures only: 338 on Top Layer, 118 on Bottom Layer

## Text on the board
Bottom Silkscreen Layer: 两只逆足脚
Top Silkscreen Layer: PB15 | PB03 | PA10 | PB13 | PA09 | PB02 | PB05 | PB12 | PA08 | PB16 | PB04 | PA11 | PB19 | PA02 | +5v | PA23 | PA20 | +3v3 | PA16 | PA22 | PB18 | PB17 | PA30 | PB01 | STEP1 | PA07 | PA00 | GND | DIR1 | STEP2 | DIR2 | PB10 | PB14 | +12V | PWMB | BIN2 | BIN1 | AIN1 | AIN2 | PWMA | EIA | E1B | E2A | E2B | PA17 | +5V | VCC | PA25 | RX | PA26 | TX | +3V3 | UART1 | UART0 | PB07 | UART2 | PA24 | PA01 | PB06 | PA21 | PB08 | PB26 | PA12 | PA13 | PA29 | TRIG | PB27 | ECHO | PA28 | PB24 | PA14 | PA15 | UART3 | SCL | SDA | PA31 | PB11 | 开 | 关
